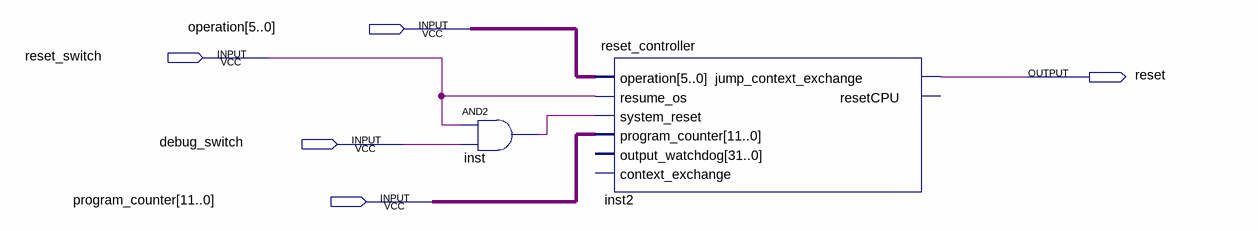
[diagram p0: schematic sheet]
// Quartus schematic schematic.bdf as structural Verilog: 2 symbols, 5 pins
module schematic (
  input  [5:0] operation,
  input  reset_switch,
  input  debug_switch,
  input  [11:0] program_counter,
  output reset
);

  wire inst_out;

  and inst (inst_out, reset_switch, debug_switch);
  reset_controller inst2 (
    .operation(operation), .resume_os(reset_switch), .system_reset(inst_out),
    .program_counter(program_counter), .jump_context_exchange(reset));  // open: output_watchdog, context_exchange, resetCPU
endmodule
